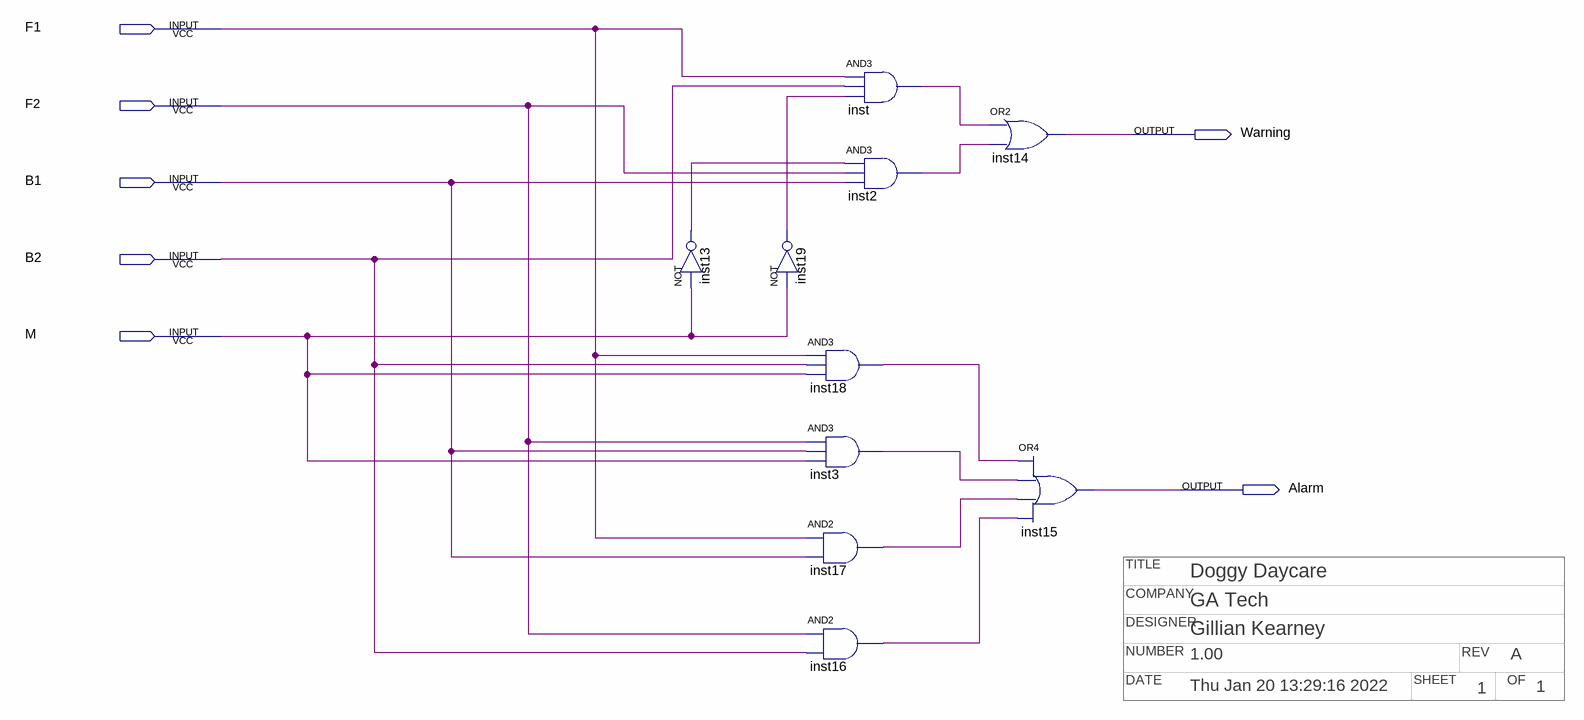
[diagram p0: schematic sheet]
// Quartus schematic DogDaycare.bdf as structural Verilog: 10 symbols, 7 pins
// Title block: COMPANY: GA Tech; DATE: Thu Jan 20 13:29:16 2022; DESIGNER: Gillian Kearney; NUMBER: 1.00; OF: 1; REV: A; SHEET: 1; TITLE: Doggy Daycare
module DogDaycare (
  input  F1,
  input  F2,
  input  B1,
  input  B2,
  input  M,
  output Warning,
  output Alarm
);

  wire inst2_out, inst3_out, inst13_out, inst16_out, inst17_out, inst18_out, inst19_out, inst_out;

  not inst13 (inst13_out, M);
  not inst19 (inst19_out, M);
  and inst (inst_out, F1, B2, inst19_out);
  and inst2 (inst2_out, inst13_out, F2, B1);
  and inst18 (inst18_out, F1, B2, M);
  and inst3 (inst3_out, F2, B1, M);
  and inst17 (inst17_out, F1, B1);
  and inst16 (inst16_out, F2, B2);
  or inst14 (Warning, inst_out, inst2_out);
  or inst15 (Alarm, inst18_out, inst3_out, inst17_out, inst16_out);
endmodule
